# Altium schematic sheet CamBoard.SchDoc
size A4
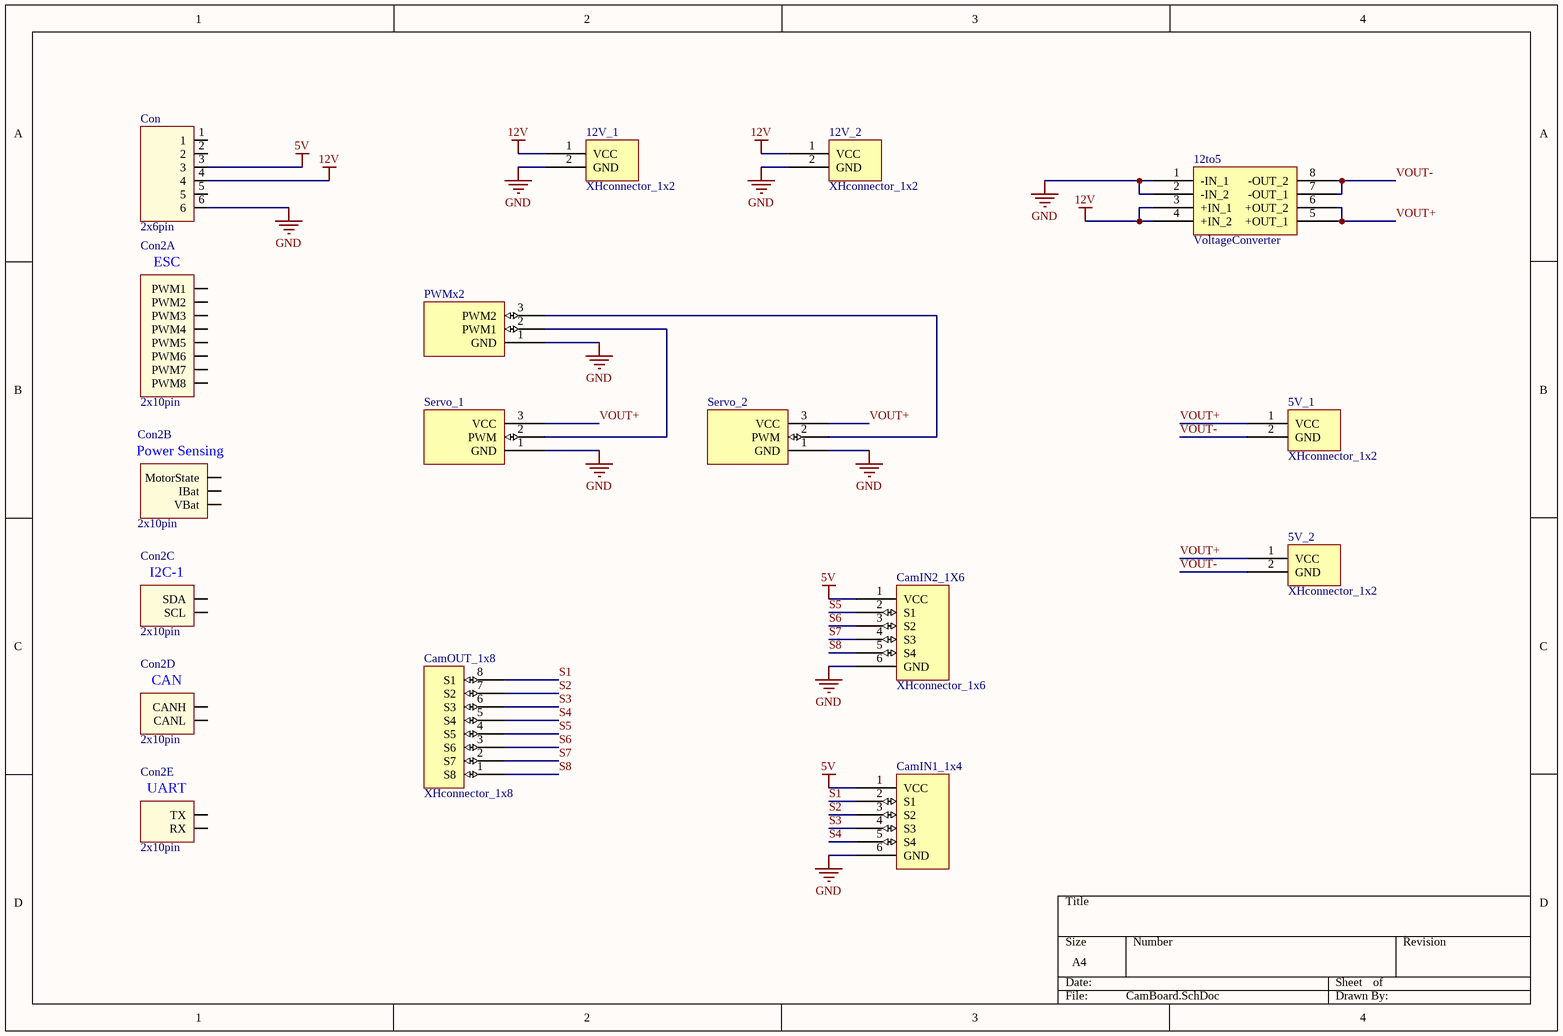
[diagram p0: CamBoard.SchDoc]

## Parts
5V_1  XHconnector_1x2  [XH1x2]
5V_2  XHconnector_1x2  [XH1x2]
12to5  VoltageConverter  [converter]
12V_1  XHconnector_1x2  [XH1x2]
12V_2  XHconnector_1x2  [XH1x2]
CamIN1_1x4  XHconnector_1x6  [XH1x6]  (value not drawn)
CamIN2_1X6  XHconnector_1x6  [XH1x6]
CamOUT_1x8  XHconnector_1x8  [XH1x8]
Con  2x6pin  [2x6pin]
Con2  2x10pin  [2x10pin]  (parts A,B,C,D,E of 5)
PWMx2  PWMx2  [XH1x3]  (value not drawn)
Servo_1  Servo  [XH1x3]  (value not drawn)
Servo_2  Servo  [XH1x3]  (value not drawn)

## Nets
5V: CamIN1_1x4.1(VCC) CamIN2_1X6.1(VCC) Con.3
12V: 12to5.3(+IN_1) 12to5.4(+IN_2) 12V_1.1(VCC) 12V_2.1(VCC) Con.4
GND: 12to5.1(-IN_1) 12to5.2(-IN_2) 12V_1.2(GND) 12V_2.2(GND) CamIN1_1x4.6(GND) CamIN2_1X6.6(GND) Con.6 PWMx2.1(GND) Servo_1.1(GND) Servo_2.1(GND)
S1: CamIN1_1x4.2(S1) CamOUT_1x8.8(S1)
S2: CamIN1_1x4.3(S2) CamOUT_1x8.7(S2)
S3: CamIN1_1x4.4(S3) CamOUT_1x8.6(S3)
S4: CamIN1_1x4.5(S4) CamOUT_1x8.5(S4)
S5: CamIN2_1X6.2(S1) CamOUT_1x8.4(S5)
S6: CamIN2_1X6.3(S2) CamOUT_1x8.3(S6)
S7: CamIN2_1X6.4(S3) CamOUT_1x8.2(S7)
S8: CamIN2_1X6.5(S4) CamOUT_1x8.1(S8)
VOUT+: 5V_1.1(VCC) 5V_2.1(VCC) 12to5.5(+OUT_1) 12to5.6(+OUT_2) Servo_1.3(VCC) Servo_2.3(VCC)
VOUT-: 5V_1.2(GND) 5V_2.2(GND) 12to5.7(-OUT_1) 12to5.8(-OUT_2)
NetPWMx2_2: PWMx2.2(PWM1) Servo_1.2(PWM)
NetPWMx2_3: PWMx2.3(PWM2) Servo_2.2(PWM)

Not connected (* = marked no-connect by the designer): Con 1 2 5; Con2 1(PWM1) 2(PWM2) 3(PWM3) 4(PWM4) 5(PWM5) 6(PWM6) 7(PWM7) 8(PWM8) 10(MotorState) 11(IBat) 12(VBat) 13(SDA) 14(SCL) 15(CANH) 16(CANL) 19(TX) 20(RX)

## Notes on the sheet
- (in symbol 2x10pin, part A) ESC
- (in symbol 2x10pin, part B) Power Sensing
- (in symbol 2x10pin, part C) I2C-1
- (in symbol 2x10pin, part D) CAN
- (in symbol 2x10pin, part E) UART